# Altium schematic sheet [06] - SATA, CFAST.SchDoc
size A3; DocumentNumber: 2; SheetNumber: 6; SheetTotal: 20
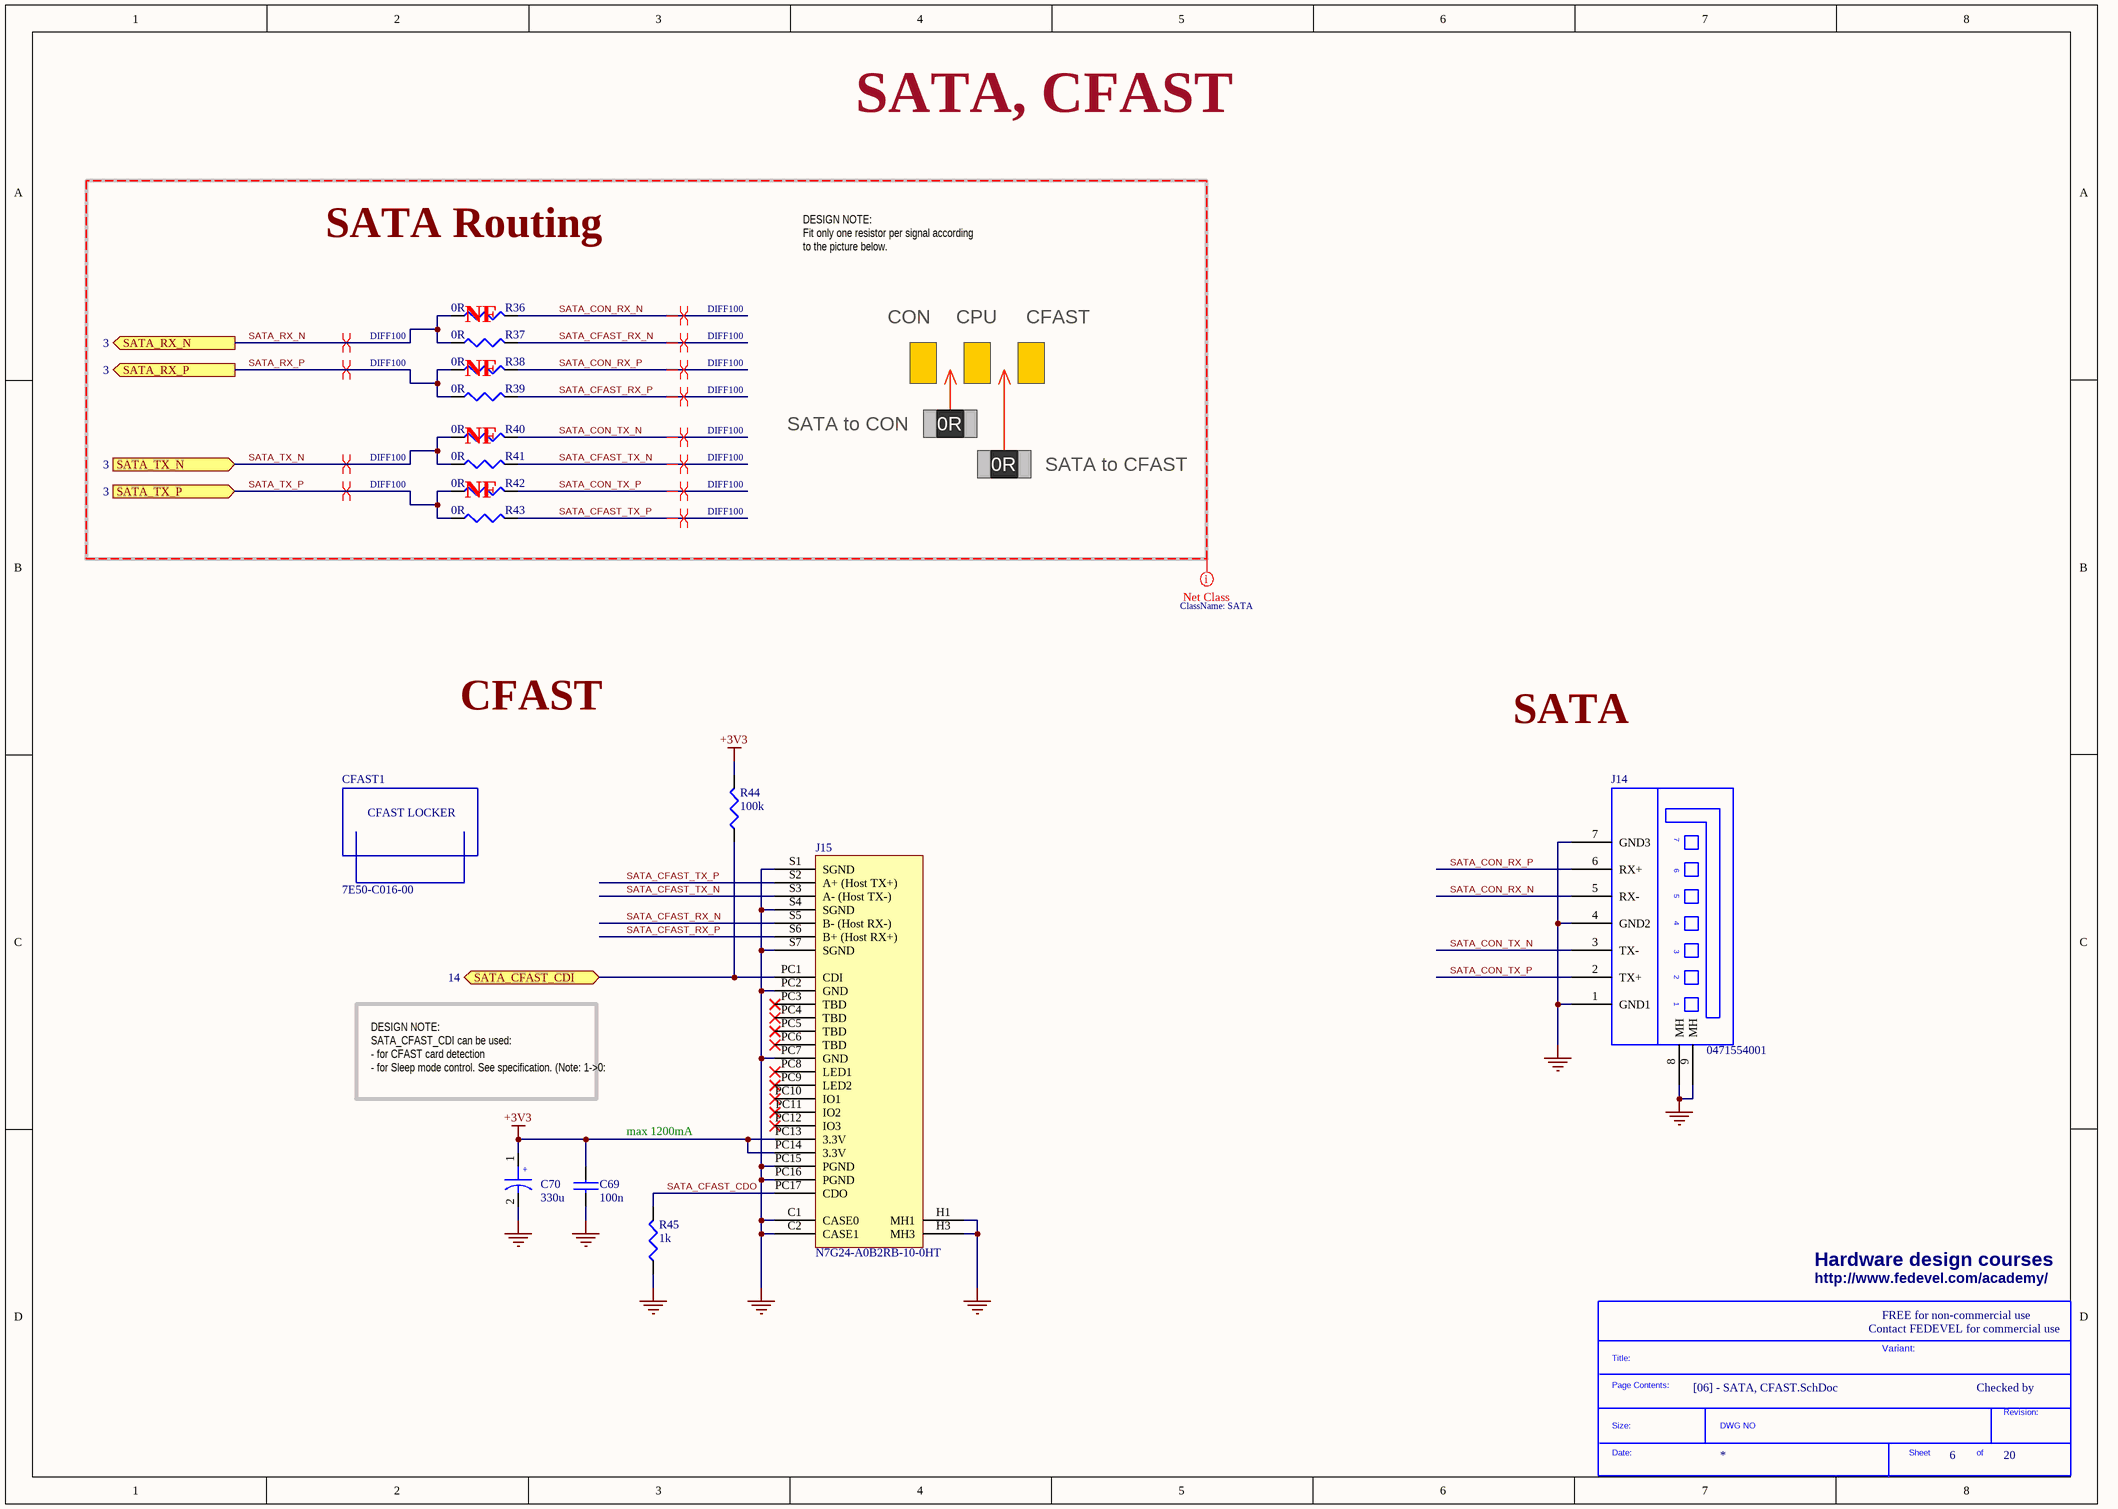
[diagram p0: [06] - SATA, CFAST.SchDoc]

## Parts
*  SDTitleBlock  (value not drawn)  (graphical)
C69  100n  [C0402]
C70  330u  [C2917]
CFAST1  7E50-C016-00  [CFAST_LOCKER]
J14  0471554001  [SATA_VERTICAL]
J15  N7G24-A0B2RB-10-0HT  [CFAST10]
R36  0R  [R0402]
R37  0R  [R0402]
R38  0R  [R0402]
R39  0R  [R0402]
R40  0R  [R0402]
R41  0R  [R0402]
R42  0R  [R0402]
R43  0R  [R0402]
R44  100k  [R0402]
R45  1k  [R0402]

## Blocks framed on the sheet
SATA Routing: R36-R43

## Ports
SATA_CFAST_CDI (bidir, see 14), SATA_RX_N (out, see 3), SATA_RX_P (out, see 3), SATA_TX_N (in, see 3), SATA_TX_P (in, see 3)

## Nets
+3V3: C69.1 C70.1 J15.PC13(3.3V) J15.PC14(3.3V) R44.2
GND: C69.2 C70.2 J14.1(GND1) J14.4(GND2) J14.7(GND3) J14.8(MH) J14.9(MH) J15.C1(CASE0) J15.C2(CASE1) J15.H1(MH1) J15.H3(MH3) J15.PC2(GND) J15.PC7(GND) J15.PC15(PGND) J15.PC16(PGND) J15.S1(SGND) J15.S4(SGND) J15.S7(SGND) R45.1
SATA_CFAST_CDI: J15.PC1(CDI) R44.1 ; port SATA_CFAST_CDI
SATA_CFAST_CDO: J15.PC17(CDO) R45.2
SATA_CFAST_RX_N: J15.S5(B-_(Host_RX-)) R37.2
SATA_CFAST_RX_P: J15.S6(B+_(Host_RX+)) R39.2
SATA_CFAST_TX_N: J15.S3(A-_(Host_TX-)) R41.2
SATA_CFAST_TX_P: J15.S2(A+_(Host_TX+)) R43.2
SATA_CON_RX_N: J14.5(RX-) R36.2
SATA_CON_RX_P: J14.6(RX+) R38.2
SATA_CON_TX_N: J14.3(TX-) R40.2
SATA_CON_TX_P: J14.2(TX+) R42.2
SATA_RX_N: R36.1 R37.1 ; port SATA_RX_N
SATA_RX_P: R38.1 R39.1 ; port SATA_RX_P
SATA_TX_N: R40.1 R41.1 ; port SATA_TX_N
SATA_TX_P: R42.1 R43.1 ; port SATA_TX_P

Not connected (* = marked no-connect by the designer): J15 H2 H4 H5 H6 PC3(TBD)* PC4(TBD)* PC5(TBD)* PC6(TBD)* PC8(LED1)* PC9(LED2)* PC10(IO1)* PC11(IO2)* PC12(IO3)*

## Layout directives
differential pair; net class DIFF100: SATA_CFAST_RX_N, SATA_CFAST_RX_P, SATA_CFAST_TX_N, SATA_CFAST_TX_P, SATA_CON_RX_N, SATA_CON_RX_P, SATA_CON_TX_N, SATA_CON_TX_P, SATA_RX_N, SATA_RX_P, SATA_TX_N, SATA_TX_P
net class SATA: SATA_CFAST_RX_N, SATA_CFAST_RX_P, SATA_CFAST_TX_N, SATA_CFAST_TX_P, SATA_CON_RX_N, SATA_CON_RX_P, SATA_CON_TX_N, SATA_CON_TX_P, SATA_RX_N, SATA_RX_P, SATA_TX_N, SATA_TX_P

## Notes on the sheet
- SATA, CFAST
- DESIGN NOTE:
  Fit only one resistor per signal according to the picture below.
- (near R36) NF
- (near R38) NF
- CON
- CPU
- CFAST
- (near R40) NF
- SATA to CON
- 0R
- (near R42) NF
- SATA to CFAST
- SATA
- DESIGN NOTE:
  SATA_CFAST_CDI can be used:
  - for CFAST card detection
  - for Sleep mode control. See specification. (Note: 1->0: Deasserted; 0->1 Asserted)
- max 1200mA
- Hardware design courses
- http://www.fedevel.com/academy/
- Contact FEDEVEL for commercial use
- FREE for non-commercial use
- Variant:
- Checked by
- (in symbol 7E50-C016-00) CFAST LOCKER
- (in symbol SDTitleBlock) Title:; Page Contents:; Revision:; Size:; DWG NO; Date:; Sheet; of
- (in symbol T520D337M006ATE045) +

## Library data of the parts
C69 = C1005X5R1H104K: CAP CER .10UF 50V X5R 10% 0402; Manufacturer: TDK Corporation; Capacitance: 0.1µF; Value: 100nF; .Checked PCB: used; Description: CAP CER 0.1UF 50V 10% X5R 0402; Category: Capacitors; Supplier Part Number: 445-5942-1-ND; Manufacturer Part Number: C1005X5R1H104K; Operating Temperature: -55°C ~ 85°C; Package / Case: 0402 (1005 Metric); Price 1k [$]: 0.02340; .Checked SCH: used; Voltage - Rated: 50V; Supplier: Digikey; Supplier 1: Digi-Key; Supplier Part Number 1: 445-5942-1-ND; RoHS: RoHS Compliant; Stock 1: 106926; Pricing 1: 1=0.27, 10=0.18, 100=0.072, 250=0.05176, 500=0.0369, 1000=0.027 (USD); Tolerance: ±10%; Temperature Coefficient: X5R; Mounting Type: Surface Mount, MLCC; Applications: General Purpose; Ratings: -; Size / Dimension: 0.039" L x 0.020" W (1.00mm x 0.50mm); Height - Seated (Max): -; Thickness (Max): 0.022" (0.55mm); Lead Spacing: -; Features: -; Packaging: Cut Tape (CT); Lead Style: -; ComponentLink1URL: http://www.tdk.co.jp/tefe02/e412_c.pdf; ComponentLink1Description: http://www.tdk.co.jp/tefe02/e412_c.pdf
C70 = T520D337M006ATE045: CAP TANT 330UF 6.3V 20% 2917; Manufacturer: Kemet; Manufacturer Size Code: D; Capacitance: 330µF; ESR (Equivalent Series Resistance): 45 mOhm; Type: Molded; .Creator: MM; .Checked SCH: RF, used by MM; Supplier 1: Digi-Key; Manufacturer Part Number: T520D337M006ATE045; RoHS: RoHS Compliant; Category: Capacitors; Stock 1: 11758; Pricing 1: 1=1.33, 10=1.05, 50=0.91, 100=0.7875, 250=0.7 (USD); Packaging: Cut Tape (CT); Voltage - Rated: 6.3V; Tolerance: ±20%; Operating Temperature: -55°C ~ 105°C; Mounting Type: Surface Mount; Package / Case: 2917 (7343 Metric); Size / Dimension: 0.287" L x 0.169" W (7.30mm x 4.30mm); Height - Seated (Max): 0.122" (3.10mm); Lead Spacing: -; Features: Polymer; Lifetime @ Temp.: -; ComponentLink1URL: http://www.kemet.com/kemet/web/homepage/kechome.nsf/file/T520%20Series/$file/KEM_T2015_T520.pdf; ComponentLink1Description: http://www.kemet.com/kemet/web/homepage/kechome.nsf/file/T520%20Series/$file/KEM_T2015_T520.pdf; Supplier Part Number 1: 399-4055-1-ND; .Checked PCB: MM
CFAST1 = 7E50-C016-00: CF CARD EJECT/LATCHING RETAINER; Manufacturer: 3M; Accessory Type: Latch Retainer; For Use With/Related Products: CompactFlash® - Type II; .Checked PCB: RF; Supplier 1: Digi-Key; Supplier Part Number 1: 3M9681-ND; Manufacturer Part Number: 7E50-C016-00; RoHS: RoHS Compliant; Category: Connectors, Interconnects; Stock 1: 1200; Pricing 1: 1=2.62, 10=2.377, 50=2.134, 100=2.037, 250=1.843, 500=1.6975, 1000=1.455, 2500=1.358, 5000=1.2901 (USD); Packaging: Tray; ComponentLink1URL: http://multimedia.3m.com/mws/mediawebserver?mwsId=SSSSSu7zK1fslxtUmYtxPY_Zev7qe17zHvTSevTSeSSSSSS--; ComponentLink1Description: http://multimedia.3m.com/mws/mediawebserver?mwsId=SSSSSu7zK1fslxtUmYtxPY_Zev7qe17zHvTSevTSeSSSSSS--; .Checked SCH: RF
J14 = 0471554001: CONN SATA HDR 7POS PCB VERT; Manufacturer: Molex Inc; Connector Style: Header, Shrouded; Number of Positions: 7; .Checked PCB: RF; Supplier 1: Digi-Key; Supplier Part Number 1: WM4059-ND; Manufacturer Part Number: 0471554001; RoHS: RoHS Compliant; Category: Connectors, Interconnects; Stock 1: 8065; Pricing 1: 1=1.37, 10=1.065, 25=0.9928, 50=0.9026, 100=0.8123, 250=0.68592, 500=0.6498, 1000=0.5776, 2500=0.48013 (USD); Connector Type: SATA; Mounting Type: Through Hole; Termination: Solder; Features: Board Lock; Contact Finish: Gold; Contact Finish Thickness: Flash; Packaging: Tray; ComponentLink1URL: http://www.molex.com/elqNow/elqRedir.htm?ref=http://www.molex.com/pdm_docs/sd/471554001_sd.pdf; ComponentLink1Description: http://www.molex.com/elqNow/elqRedir.htm?ref=http://www.molex.com/pdm_docs/sd/471554001_sd.pdf; .Checked SCH: RF
J15 = N7G24-A0B2RB-10-0HT: CFAST HEADER STANDOFF SMD R/A; Manufacturer: 3M; Card Type: CFast™ - Type I, II; Number of Positions: 24; Connector Type: Connector; Insertion, Removal Method: Push In, Pull Out; .Checked PCB: RF; Supplier 1: Digi-Key; Supplier Part Number 1: 3M9678-ND; Manufacturer Part Number: N7G24-A0B2RB-10-0HT; RoHS: RoHS Compliant; Category: Connectors, Interconnects; Stock 1: 703; Pricing 1: 1=6.58, 10=6.302, 50=5.48, 100=5.206, 250=4.658, 500=4.384, 1000=3.836, 2500=3.6442, 5000=3.562 (USD); Ejector Side: -; Mounting Type: Surface Mount, Right Angle; Features: Board Guide, Card Guide; Height Above Board: 0.303" (7.70mm); Mounting Feature: Normal, Standard - Top; Packaging: Tray; Contact Finish: Gold; Contact Finish Thickness: 30µin (0.76µm); ComponentLink1URL: http://multimedia.3m.com/mws/mediawebserver?mwsId=SSSSSu7zK1fslxtUO8_Glx2Uev7qe17zHvTSevTSeSSSSSS--; ComponentLink1Description: http://multimedia.3m.com/mws/mediawebserver?mwsId=SSSSSu7zK1fslxtUO8_Glx2Uev7qe17zHvTSevTSeSSSSSS--; .Checked SCH: RF
R36-R43 = RC0402JR-070RL: RES 0.0 OHM 1/16W 0402 SMD; Manufacturer: Yageo; Resistance (Ohms): 0.0; Power (Watts): 0.063W, 1/16W; Tolerance: Jumper; .Checked PCB: used; Category: Resistors; Manufacturer Part Number: RC0402JR-070RL; Package / Case: 0402 (1005 Metric); Price 1k [$]: 0.01389; Value: 0R; .Checked SCH: used; Supplier Part Number: 311-0.0JRCT-ND; Supplier: Digikey; Supplier 1: Digi-Key; Supplier Part Number 1: 311-0.0JRCT-ND; RoHS: RoHS Compliant; Stock 1: 1106330; Pricing 1: 10=0.012, 50=0.009, 100=0.0069, 250=0.00512, 500=0.0038, 1000=0.00253 (USD); Composition: Thick Film; Features: -; Temperature Coefficient: -; Size / Dimension: 0.039" L x 0.020" W (1.00mm x 0.50mm); Height: 0.016" (0.40mm); Number of Terminations: 2; Packaging: Cut Tape (CT); ComponentLink1URL: http://www.yageo.com/documents/recent/PYu-RC0402_51_RoHS_L_6.pdf; ComponentLink1Description: http://www.yageo.com/documents/recent/PYu-RC0402_51_RoHS_L_6.pdf
R44 = RMCF0402FT100K: RES 100K OHM 1/16W 1% 0402 SMD; Manufacturer: Stackpole Electronics Inc; Power (Watts): 0.063W, 1/16W; .Checked PCB: used; Temperature Coefficient: ±100ppm/°C; Category: Resistors; Supplier Part Number: RMCF0402FT100KCT-ND; Manufacturer Part Number: RMCF0402FT100K; Package / Case: 0402 (1005 Metric); Price 1k [$]: 0.00384; Resistance (Ohms): 100K; Tolerance: ±1%; Value: 100k; .Checked SCH: used; Supplier: Digikey; Supplier 1: Digi-Key; Supplier Part Number 1: RMCF0402FT100KCT-ND; RoHS: RoHS Compliant; Stock 1: 95; Pricing 1: 1=0.04, 10=0.025, 50=0.0138, 100=0.0105, 250=0.0078, 500=0.00576, 1000=0.00384 (USD); Composition: Thick Film; Features: -; Size / Dimension: 0.039" L x 0.020" W (1.00mm x 0.50mm); Height: 0.016" (0.40mm); Number of Terminations: 2; Packaging: Cut Tape (CT); ComponentLink1URL: http://www.seielect.com/Catalog/SEI-RMCF.pdf; ComponentLink1Description: http://www.seielect.com/Catalog/SEI-RMCF.pdf
R45 = RC0402FR-071KL: RES 1.00K OHM 1/16W 1% 0402 SMD; Manufacturer: Yageo; Power (Watts): 0.063W, 1/16W; .Checked PCB: used; Temperature Coefficient: ±100ppm/°C; Category: Resistors; Supplier Part Number: 311-1.00KLRCT-ND; Manufacturer Part Number: RC0402FR-071KL; Package / Case: 0402 (1005 Metric); Price 1k [$]: 0.01421; Resistance (Ohms): 1K; Tolerance: ±1%; Value: 1k; .Checked SCH: used; Supplier: Digikey; Supplier 1: Digi-Key; Supplier Part Number 1: 311-1.00KLRCT-ND; RoHS: RoHS Compliant; Stock 1: 1753477; Pricing 1: 10=0.014, 50=0.0104, 100=0.0079, 250=0.00584, 500=0.00432, 1000=0.00288 (USD); Composition: Thick Film; Features: -; Size / Dimension: 0.039" L x 0.020" W (1.00mm x 0.50mm); Height: 0.016" (0.40mm); Number of Terminations: 2; Packaging: Cut Tape (CT); ComponentLink1URL: http://www.yageo.com/documents/recent/PYu-RC0402_51_RoHS_L_6.pdf; ComponentLink1Description: http://www.yageo.com/documents/recent/PYu-RC0402_51_RoHS_L_6.pdf